# EAGLE design badge (EAGLE 9.6.2)
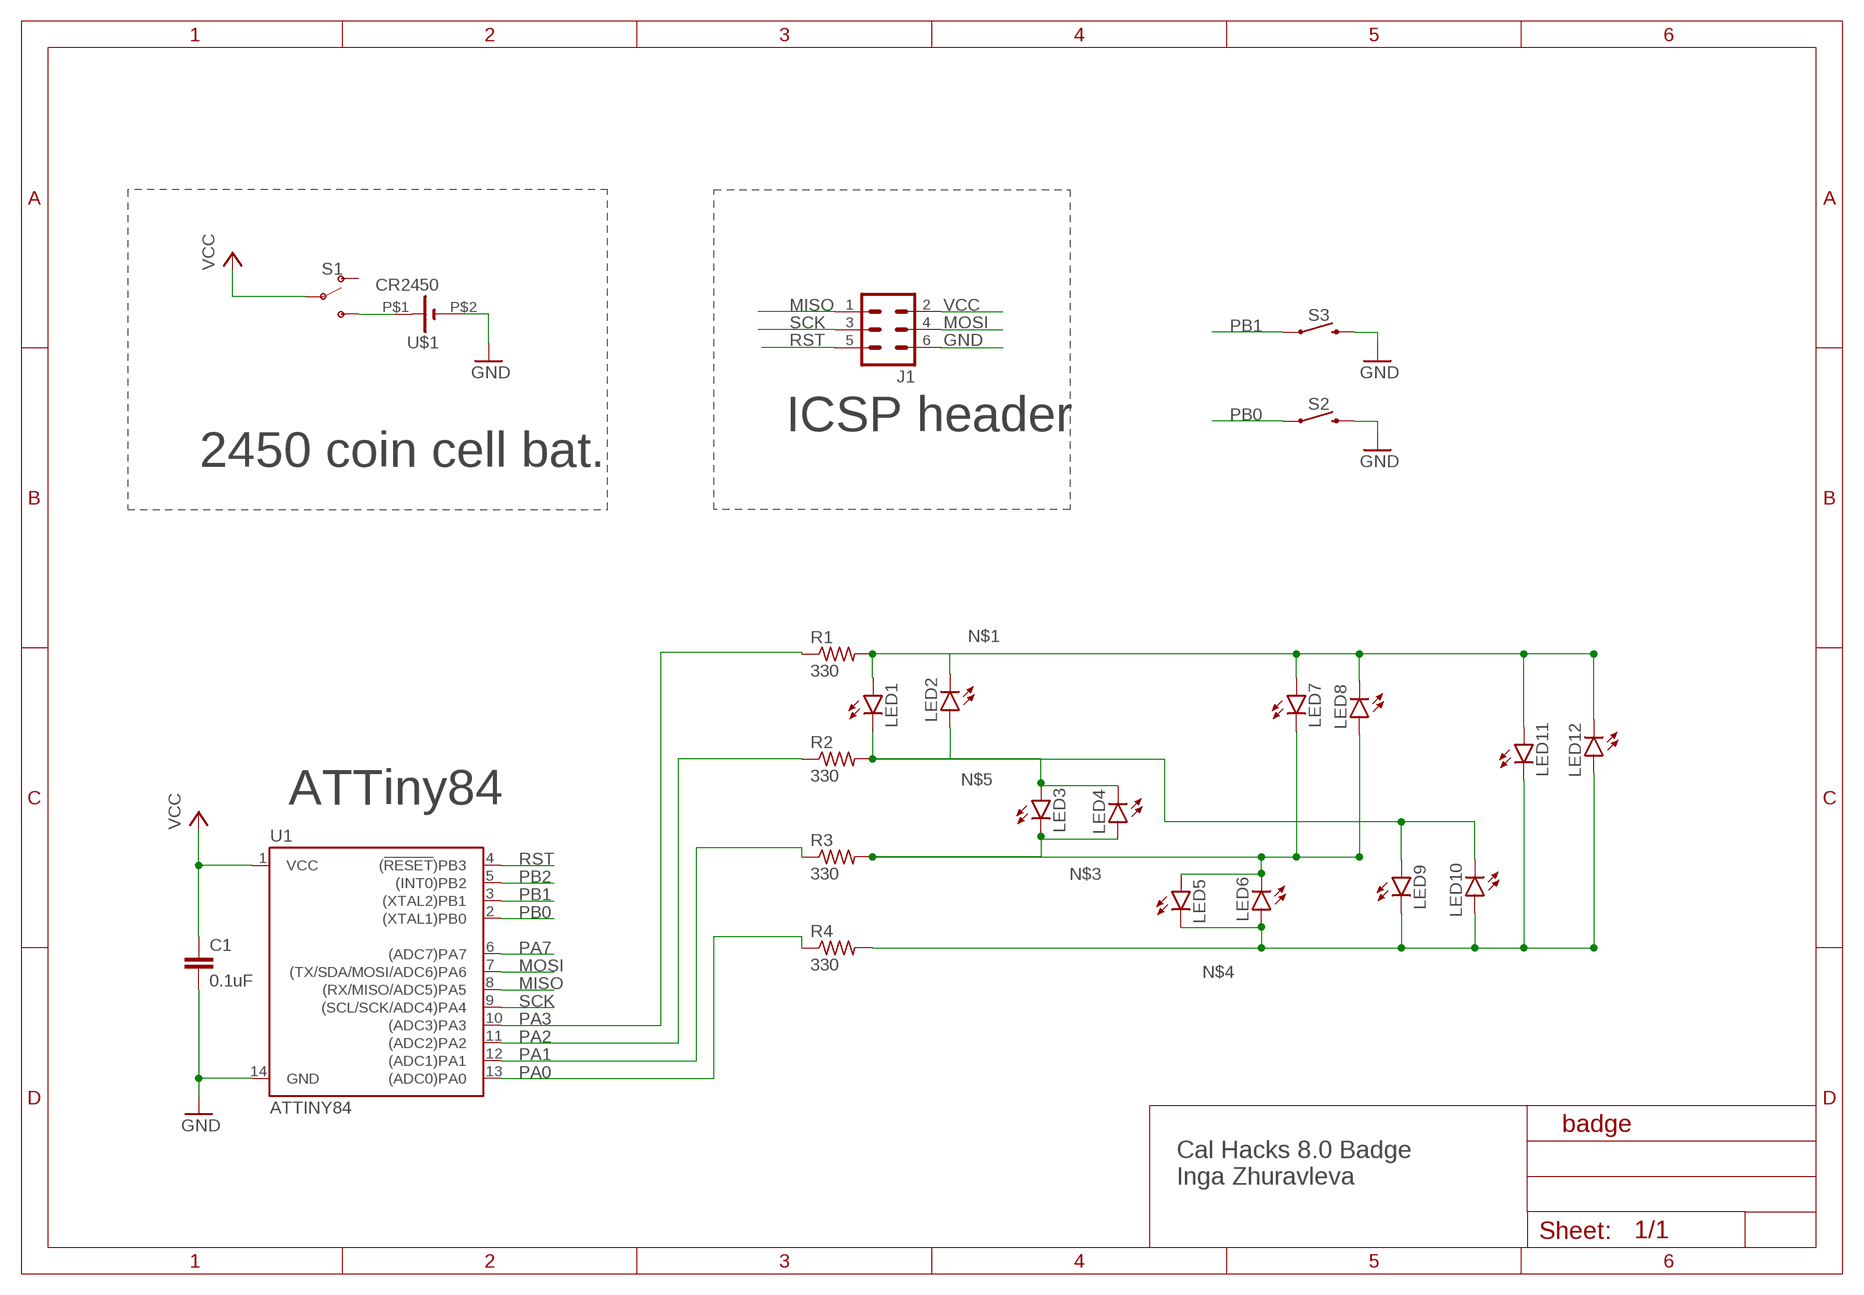
[diagram p0: schematic, sheet 1]

## Parts
C1  0.1uF  C-EUC0603  [C0603]
J1  MA03-2  [MA03-2]
LED1  LED3MM  [LED3MM]
LED2  LED3MM  [LED3MM]
LED3  LED3MM  [LED3MM]
LED4  LED3MM  [LED3MM]
LED5  LED3MM  [LED3MM]
LED6  LED3MM  [LED3MM]
LED7  LED3MM  [LED3MM]
LED8  LED3MM  [LED3MM]
LED9  LED3MM  [LED3MM]
LED10  LED3MM  [LED3MM]
LED11  LED3MM  [LED3MM]
LED12  LED3MM  [LED3MM]
R1  330  R-US_R0805  [R0805]
R2  330  R-US_R0805  [R0805]
R3  330  R-US_R0805  [R0805]
R4  330  R-US_R0805  [R0805]
S1  SWITCH-SPDT-PTH-11.6X4.0MM-KIT  [SWITCH_SPDT_PTH_11.6X4.0MM_KIT]
S2  MOMENTARY-SWITCH-SPST-SMD-6.2MM-TALL  [TACTILE_SWITCH_SMD_6.2MM_TALL]
S3  MOMENTARY-SWITCH-SPST-SMD-6.2MM-TALL  [TACTILE_SWITCH_SMD_6.2MM_TALL]
U1  ATTINY84  [SO14]
U$1  CR2450  [BAT_2450_XL]

## Nets
GND: C1.2 J1.6 S2.B2 S3.B2 U1.14(GND) U$1.P$2(-)
MISO: J1.1 U1.8((RX/MISO/ADC5)PA5)
MOSI: J1.4 U1.7((TX/SDA/MOSI/ADC6)PA6)
N$1: LED1.A LED2.K(C) LED7.A LED8.K(C) LED11.A LED12.K(C) R1.2
N$2: S1.3(S) U$1.P$1(+)
N$3: LED3.K(C) LED4.A LED5.A LED6.K(C) LED7.K(C) LED8.A R3.2
N$4: LED5.K(C) LED6.A LED9.K(C) LED10.A LED11.K(C) LED12.A R4.2
N$5: LED1.K(C) LED2.A LED3.A LED4.K(C) LED9.A LED10.K(C) R2.2
PA0: R4.1 U1.13((ADC0)PA0)
PA1: R3.1 U1.12((ADC1)PA1)
PA2: R2.1 U1.11((ADC2)PA2)
PA3: R1.1 U1.10((ADC3)PA3)
PA7: U1.6((ADC7)PA7)
PB0: S2.A2 U1.2((XTAL1)PB0)
PB1: S3.A2 U1.3((XTAL2)PB1)
PB2: U1.5((INT0)PB2)
RST: J1.5 U1.4((!RESET!)PB3)
SCK: J1.3 U1.9((SCL/SCK/ADC4)PA4)
VCC: C1.1 J1.2 S1.2(P) U1.1(VCC)
Unconnected: S1.1(O)

## Notes on the sheet
- ICSP header
- 2450 coin cell bat.
- ATTiny84
- Cal Hacks 8.0 Badge
  Inga Zhuravleva

## Library data of the parts
C1 = rcl:C-EU: CAPACITOR, European symbol; SPICEPREFIX: C
J1 = con-lstb:MA03-2: PIN HEADER; OC_FARNELL: unknown; OC_NEWARK: unknown
LED1-LED12 = led:LED: LED OSRAM: - CHIPLED LG R971, LG N971, LY N971, LG Q971, LY Q971, LO R971, LY R971 LH N974, LH R974 LS Q976, LO Q976, LY Q976 LO Q996 - Hyper CHIPLED LW Q18S LB Q993, LB Q99A, LB R99A - SideLED LS A670, LO A670, LY A670, LG A670, LP A670 LB A673, LV A673, LT A673, LW A673 LH A674 LY A675 LS A676, LA A676, LO A676, LY A676, LW A676 LS A679, LY A679, LG A679 - Hyper Micro SIDELED® LS Y876, LA Y876, LO Y876, LY Y876 LT Y87S - SmartLED LW L88C, LW L88S LB L89C, LB L89S, LG L890 LS L89K, LO L89K, LY L89K LS L896, LA L896, LO L896, LY L896 - TOPLED LS T670, LO T670, LY T670, LG T670, LP T670 LSG T670, LSP T670, LSY T670, LOP T670, LYG T670 LG T671, LOG T671, LSG T671 LB T673, LV T673, LT T673, LW T673 LH T674 LS T676, LA T676, LO T676, LY T676, LB T676, LH T676, LSB T676, LW T676 LB T67C, LV T67C, LT T67C, LS T67K, LO T67K, LY T67K, LW E67C LS E67B, LA E67B, LO E67B, LY E67B, LB E67C, LV E67C, LT E67C LW T67C LS T679, LY T679, LG T679 LS T770, LO T770, LY T770, LG T770, LP T770 LB T773, LV T773, LT T773, LW T773 LH T774 LS E675, LA E675, LY E675, LS T675 LS T776, LA T776, LO T776, LY T776, LB T776 LHGB T686 LT T68C, LB T68C - Hyper Mini TOPLED® LB M676 - Mini TOPLED Santana® LG M470 LS M47K, LO M47K, LY M47K Source: http://www.osram.convergy.de LUXEON: - LUMILED® LXK2-PW12-R00, LXK2-PW12-S00, LXK2-PW14-U00, LXK2-PW14-V00 LXK2-PM12-R00, LXK2-PM12-S00, LXK2-PM14-U00 LXK2-PE12-Q00, LXK2-PE12-R00, LXK2-PE12-S00, LXK2-PE14-T00, LXK2-PE14-U00 LXK2-PB12-K00, LXK2-PB12-L00, LXK2-PB12-M00, LXK2-PB14-N00, LXK2-PB14-P00, LXK2-PB14-Q00 LXK2-PR12-L00, LXK2-PR12-M00, LXK2-PR14-Q00, LXK2-PR14-R00 LXK2-PD12-Q00, LXK2-PD12-R00, LXK2-PD12-S00 LXK2-PH12-R00, LXK2-PH12-S00 LXK2-PL12-P00, LXK2-PL12-Q00, LXK2-PL12-R00 Source: www.luxeon.com KINGBRIGHT: KA-3528ASYC Source: www.kingbright.com
R1-R4 = rcl:R-US_: RESISTOR, American symbol; SPICEPREFIX: R
S1 = SparkFun-Switches:SWITCH-SPDT: Single Pole, Double Throw (SPDT) Switch Single-pole, double-throw (SPDT) switch. Variant Overview SMD-AYZ0202 Surface Mount DPDT Switch (COM-00597) Used on e.g. LilyPad Arduino USB - ATmega32U4 Board PTH-11.6X4.0MM SPDT Mini Power Switch (COM-00102) Used on e.g. SparkFun Simon Says - Through-Hole Soldering Kit (KIT-10547) PTH-11.6X4.0MM-KIT KIT version of SPDT Mini Power Switch - Simplifies soldering by removing tStop of switch pins - only one side can be soldered. PTH-11.6X4.0MM-LOCK LOCK version of SPDT Mini Power Switch - Offset pins hold switch in place for easier soldering. SMD-RIGHT-ANGLE Surface Mount Right Angle Switch (COM-10860) Used on e.g. SparkFun ESP8266 Thing; PROD_ID: SWCH-08261; SF_SKU: COM-00102
S2 S3 = SparkFun-Switches:MOMENTARY-SWITCH-SPST: Momentary Switch (Pushbutton) - SPST Normally-open (NO) SPST momentary switches (buttons, pushbuttons). Variants PTH-12MM - 12mm square, through-hole Momentary Pushbutton Switch - 12mm Square (COM-09190) PTH-6.0MM, PTH-6.0MM-KIT - 6.0mm square, through-hole Mini Pushbutton Switch (COM-00097) KIT package intended for soldering kit's - only one side of pads' copper is exposed. PTH-RIGHT-ANGLE-KIT - Right-angle, through-hole Right Angle Tactile Button - Used on SparkFun BigTime Watch Kit SMD-12MM - 12mm square, surface-mount Tactile Button - SMD (12mm) (COM-12993) Used on SparkFun PicoBoard SMD-4.5MM - 4.5mm Square Trackball Switch Used on SparkFun Blackberry Trackballer Breakout SMD-4.6MMX2.8MM - 4.60mm x 2.80mm, surface mount Used on SparkFun SAMD21 Mini Breakout SMD-5.2MM, SMD-5.2-REDUNDANT - 5.2mm square, surface-mount Mini Pushbutton Switch - SMD (COM-08720) Used on Arduino Pro Mini REDUNDANT package connects both switch circuits together SMD-6.0X3.5MM - 6.0 x 3.5mm, surface mount Momentary Reset Switch SMD (COM-08229) SMD-6.2MM-TALL - 6.2mm square, surface mount Tactile Button - SMD (6mm) Used on SparkFun Digital Sandbox SMD-RIGHT-ANGLE - Right-angle, surface mount Used on SparkFun Block for Intel® Edison - Arduino; PROD_ID: SWCH-11966; SF_SKU: COM-12992
U1 = SparkFun-IC-Microcontroller:ATTINY84: Atmel 14-pin 2/4/8kB flash uC Datasheet SparkFun Products Tiny AVR Programmer (PGM-11801) SparkFun Servo Trigger - Continuous Rotation (WIG-13872) SparkFun Servo Trigger (WIG-13118); PROD_ID: IC-11285
U$1 = CR2450:CR2450: SMTU 2450N-1-LF - Battery Holder, 2450 x 1, SMD Renata SMTU 2450N-1-LF Farnell 1216356 https://no.farnell.com/renata/smtu-2450n-1-lf/holder-smd-battery-for-cr-2450/dp/1216356 Check prices; AVAILABILITY: In Stock; DESCRIPTION: Coin, 24.5mm Lithium Manganese Dioxide 3V Battery Non-Rechargeable (Primary); MF: Murata Electronics; MP: CR2450; PACKAGE: FBGA-256 Panasonic; PRICE: None; PURCHASE-URL: https://pricing.snapeda.com/search/part/CR2450/?ref=eda

## Board
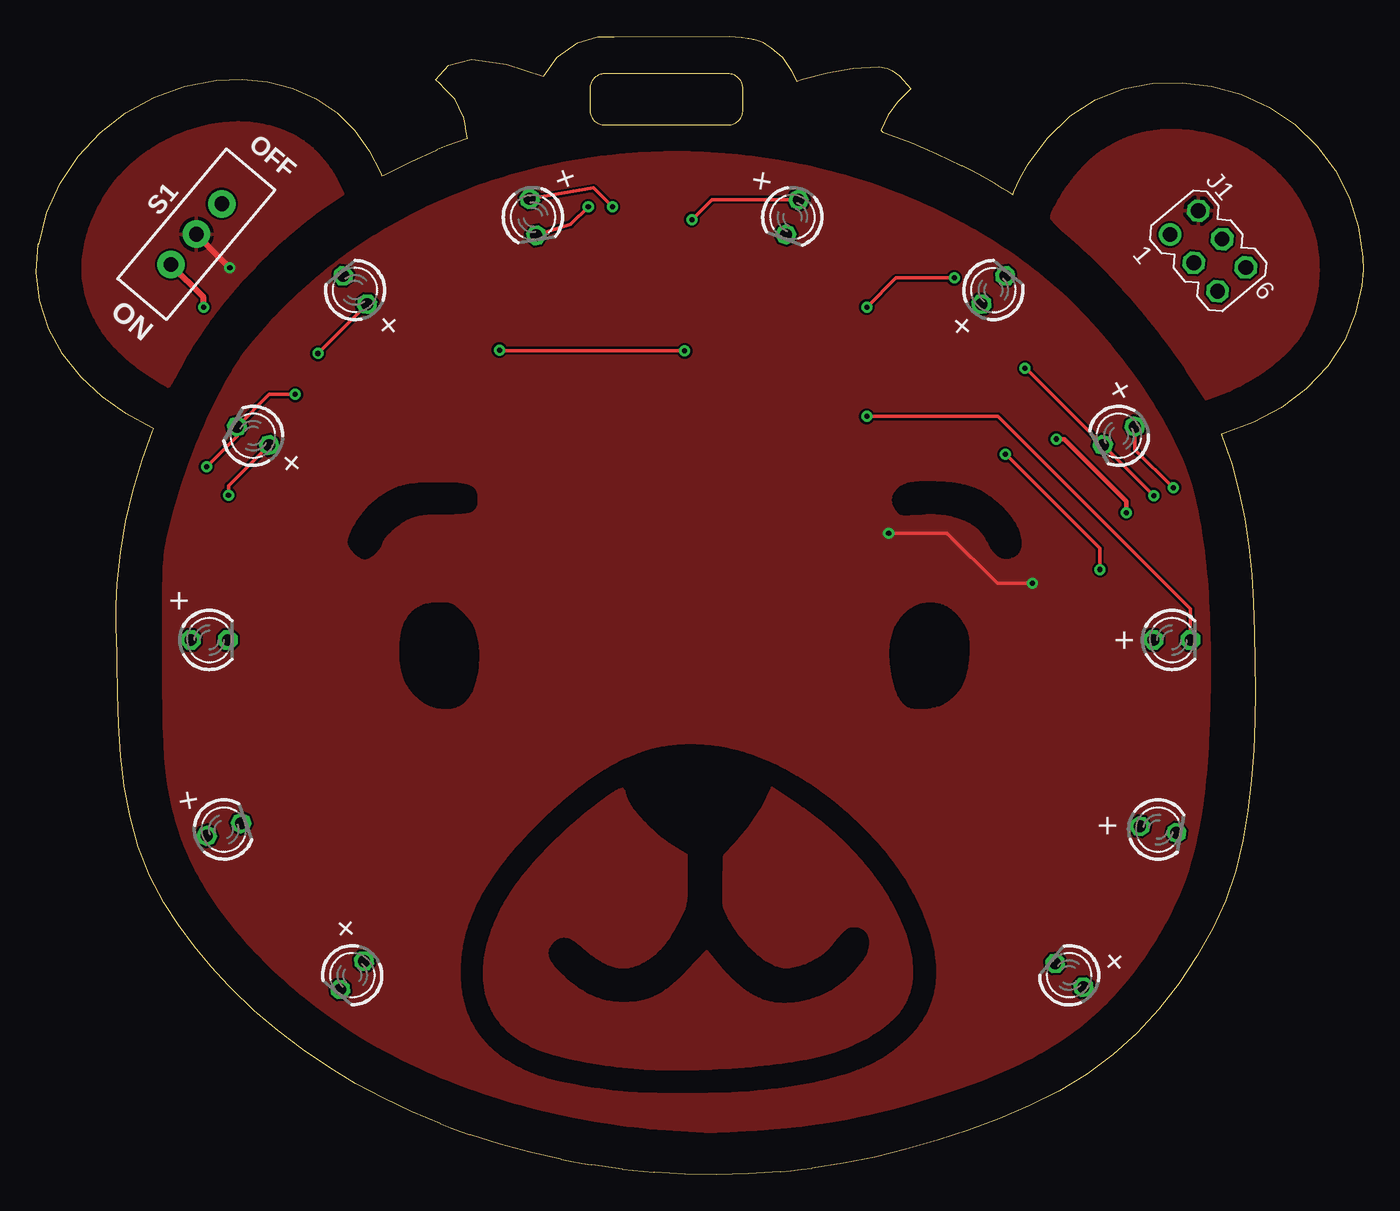
[diagram p1: board, top side]
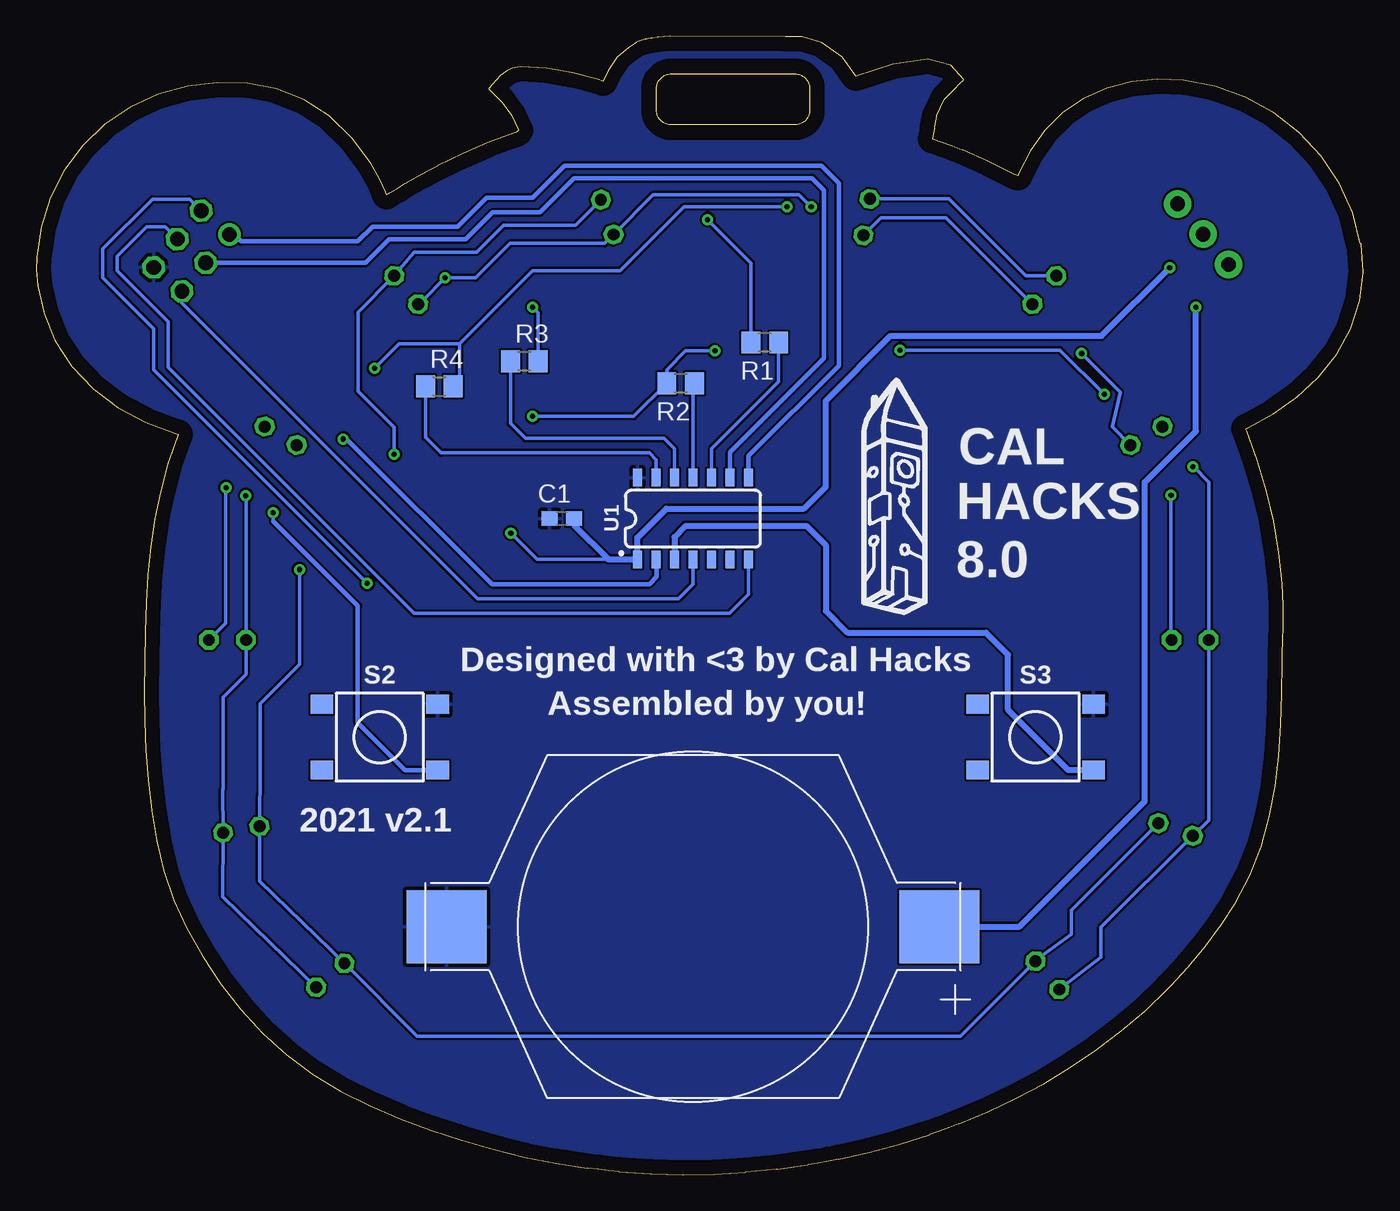
[diagram p2: board, bottom side, seen from below]

Size 91.02 x 78.06 mm. Coordinates in mm from the lower left corner, seen from the top.
Outline: 193 segments
Copper layers (1*16): Top 0.035mm / dielectric 1.5mm / Bottom 0.035mm
Design rules "default": minimum track width 6mil, minimum drill 0.35mm, track to track 6mil, track to pad 6mil, pad to pad 6mil, via to via 6mil, smd to smd 6mil, copper to edge 40mil, drill to drill 6mil, minimum pad ring 10mil, minimum via ring 8mil, stop-mask expansion 4mil, vias tented up to drill 0mil, thermal gap 10mil

### Footprints (pad centres in the part's own frame; a part is rotated, then mirrored left to right if it is on the bottom)
C0603 = smd 1.1 x 1: 1 -0.85,0; 2 0.85,0
MA03-2 = drill 1.016: 1 -2.54,-1.27 | drill 1.016 octagon: 2 -2.54,1.27; 3 0,-1.27; 4 0,1.27; 5 2.54,-1.27; 6 2.54,1.27
LED3MM = drill 0.813 octagon: A -1.27,0; K 1.27,0
R0805 = smd 1.3 x 1.5: 1 -0.95,0; 2 0.95,0
SWITCH_SPDT_PTH_11.6X4.0MM_KIT = drill 1.016 pad 1.88: 1 0,2.718; 2 0,0; 3 0,-2.718
TACTILE_SWITCH_SMD_6.2MM_TALL = smd 1.55 x 1.3: A1 -3.975,-2.25; A2 3.975,-2.25; B1 -3.975,2.25; B2 3.975,2.25
SO14 = smd 0.6 x 1.2: 1 -3.81,-2.8; 2 -2.54,-2.8; 3 -1.27,-2.8; 4 0,-2.8; 5 1.27,-2.8; 6 2.54,-2.8; 7 3.81,-2.8; 8 3.81,2.8; 9 2.54,2.8; 10 1.27,2.8; 11 0,2.8; 12 -1.27,2.8; 13 -2.54,2.8; 14 -3.81,2.8
BAT_2450_XL = smd 5.5 x 5: P$1 -16.9,0; P$2 16.9,0

### Placement (x,y rotation side)
C1  54.97,44.99 180 bottom
J1  80.38,63.34 310 top
LED1  21.66,13.66 230 top
LED2  12.86,23.66 20 top
LED3  11.86,36.66 0 top
LED4  14.86,50.66 150 top
LED5  21.86,60.66 130 top
LED6  34.06,65.66 280 top
LED7  51.86,65.66 250 top
LED8  65.66,60.66 50 top
LED9  74.26,50.66 210 top
LED10  77.91,36.66 0 top
LED11  76.96,23.66 350 top
LED12  70.86,13.66 140 top
R1  41.04,57.06 180 bottom
R2  46.82,54.26 180 bottom
R3  57.54,55.79 0 bottom
R4  63.38,54.05 0 bottom
S1  10.97,64.49 320 top
S2  67.47,29.99 0 bottom
S3  22.47,29.99 0 bottom
U1  45.97,44.99 0 bottom
U$1  45.97,16.99 180 bottom

### Tracks (layer width: path | path; a pad name or v marks a point on that pad's centre or on a via)
GND
  pour Bottom: -6.53,85.49 -6.53,-2.01 100.47,-2.01 100.47,85.49
MISO
  Bottom 0.254: J1.1 77.62,64.64
  Bottom 0.305: U1.8 42.16,49.29 35.97,55.48 35.97,67.99 37.17,69.19 54.77,69.19 56.97,66.99 60.12,66.99 62.12,64.99 67.97,64.99 68.97,63.99 76.97,63.99 77.62,64.64
MOSI
  Bottom 0.254: U1.7 42.16,39.8 43.47,38.49 65.09,38.49 81.97,55.37 81.97,58.49 85.47,61.99 85.47,62.99 83.47,64.99 82.19,64.99 J1.4
N$1  (via drill 0.35)
  Top 0.254: v72.97,41.49 72.97,42.94 66.52,49.39 v66.47,49.39 | LED7.A 46.34,66.86 v44.97,65.49
  Bottom 0.254: v44.97,65.49 41.99,62.51 R1.2 | v72.97,41.49 72.97,34.99 75.67,32.29 75.67,26.09 75.69,25.87 LED11.A 75.69,20.11 LED12.K 64.91,9.49 27.62,9.49 LED1.A 22.29,14.83 20.02,16.49 20.02,18.13 LED2.K | 66.48,61.89 LED8.K | LED8.K 65.1,63.26 60.81,63.26 58.96,65.11 54.04,65.11 LED7.A | LED8.K 68.96,59.15 68.96,53.73 66.47,51.24 v66.47,49.39
N$2  (via drill 0.35)
  Top 0.406: v11.47,59.49 11.47,60.17 S1.3
  Bottom 0.406: U$1.P$1 23.57,16.99 14.97,25.59 14.97,47.49 11.47,50.99 v11.47,59.49
N$3  (via drill 0.35)
  Top 0.254: v56.97,59.49 58.97,61.49 v62.97,61.49 | LED4.A 13.17,47.24 v13.17,46.59 | LED5.A 22.68,59.68 v19.31,56.31 | v37.86,66.36 36.66,65.16 LED6.K
  Bottom 0.254: R3.2 56.59,59.11 v56.97,59.49 | LED3.K 13.17,36.7 v13.17,46.59 | v19.31,56.31 16.66,53.66 17.21,51.28 LED4.A | v37.86,66.36 38.69,67.19 48.71,67.19 LED7.K 52.04,63.86 58.51,63.86 60.88,61.49 v62.97,61.49 64.53,59.94 LED8.A | LED6.K 33.09,65.61 28.61,65.61 LED5.A
N$4  (via drill 0.35)
  Top 0.254: LED6.A 38.21,67.67 v39.51,66.36 | v67.82,55.29 67.9,55.29 LED9.K 73.2,50.03 v76.66,46.56
  Bottom 0.254: v39.51,66.36 46.6,66.36 50.97,61.99 56.97,61.99 61.98,56.99 | 61.93,54.55 61.98,54.5 61.98,56.99 | v67.82,55.29 66.13,56.99 61.98,56.99 | v76.66,46.56 76.64,46.54 LED10.A 76.64,34.32 78.22,32.74 78.22,26.42 78.23,26.42 LED11.K 78.23,19.07 LED12.A | LED5.K 23.14,61.64 28.42,66.92 LED6.A
  Bottom 0.305: R4.2 61.98,54.5
N$5  (via drill 0.35)
  Top 0.254: v56.97,51.99 65.97,51.99 79.17,38.79 79.17,36.68 LED10.K | v44.47,56.49 31.82,56.49 | v11.67,48.54 13.76,50.63 LED4.K 15.98,53.51 v17.76,53.51 | LED9.A 75.36,49.71 77.99,47.09 v78.01,47.11
  Top 0.305: v31.77,56.54 31.82,56.49
  Bottom 0.254: v11.67,48.54 11.62,48.54 10.57,47.49 10.59,47.47 LED3.A 10.59,24.31 LED2.A 11.69,23.23 17.97,16.94 17.97,14.92 LED1.K | v56.97,51.99 50.04,51.99 R2.2 47.77,55.19 46.47,56.49 v44.47,56.49 | v17.76,53.51 20.79,56.54 v31.77,56.54 | v78.01,47.11 78.03,47.09 78.03,37.81 LED10.K
PA0
  Bottom 0.254: U1.13 48.51,49.03 48.97,49.49 63.27,49.49 64.33,50.55 R4.1
PA1
  Bottom 0.254: R3.1 58.49,51.51 57.47,50.49 47.97,50.49 47.24,49.76 U1.12
PA2
  Bottom 0.254: U1.11 45.97,54.16 R2.1
PA3
  Bottom 0.254: R1.1 40.09,54.37 44.7,49.76 U1.10
PB0  (via drill 0.35)
  Top 0.305: v74.77,45.39 74.77,46.19 70.52,50.44 v69.97,50.44
  Bottom 0.254: v74.77,45.39 74.77,44.79
  Bottom 0.305: S2.A2 65.72,27.74 68.97,30.99 68.97,38.99 74.77,44.79 | v69.97,50.44 69.72,50.44 59.77,40.49 48.97,40.49 48.47,40.99 48.47,42.15 U1.2
PB1
  Bottom 0.406: S3.A2 20.22,27.74 24.36,31.88 24.36,35.66 25.86,37.16 35.36,37.16 36.86,38.66 36.86,43.16 38.19,44.49 46.47,44.49 47.24,43.72 U1.3
RST
  Bottom 0.254: J1.5 81.04,59.78 60.75,39.49 46.97,39.49 45.97,40.49 U1.4
SCK
  Bottom 0.305: U1.9 43.43,49.53 36.97,55.99 36.97,67.49 37.82,68.34 54.12,68.34 56.47,65.99 59.72,65.99 61.57,64.14 66.82,64.14 68.44,62.53 J1.3
VCC  (via drill 0.35)
  Top 0.254: v68.32,40.54 65.92,40.54 62.47,43.99 v58.47,43.99
  Top 0.406: v13.27,62.19 S1.2
  Bottom 0.254: J1.2 80.52,66.91 83.06,66.91 86.47,63.49 86.47,61.49 82.97,57.99 82.97,55.19 v68.32,40.54 | v58.47,43.99 56.67,42.19 U1.1
  Bottom 0.406: C1.1 54.12,44.53 51.78,42.19 U1.1 49.78,43.68 47.8,45.66 38.36,45.66 36.86,47.16 36.86,53.06 32.41,57.51 17.95,57.51 v13.27,62.19
  pour Top (rank 3): 219 corners
  pour Top (rank 3): 223 corners
  pour Top (rank 3): 712 corners
  pour Top (rank 3): 219 corners
  pour Top (rank 3): 223 corners
  pour Top (rank 3): 712 corners
  pour Top (rank 3): 1577 corners

### Text on the board
bPlace: CAL | HACKS | 8.0
tNames: OFF | + | + | + | ON | + | + | + | + | + | + | + | + | +
bNames: Designed with <3 by Cal Hacks | Assembled by you! | 2021 v2.1